# EAGLE design photodiode_board (EAGLE 7.2.0)
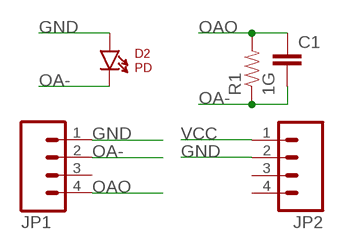
[diagram p0: schematic, sheet 1]

## Parts
C1  CAPPTH  [CAP-PTH-SMALL]
D2  PD  LTE-302  [LTE-302]
JP1  M04PTH  [1X04]
JP2  M04PTH  [1X04]
R1  1G  RESISTORAXIAL-0.3  [AXIAL-0.3]

## Nets
GND: D2.A JP1.1 JP2.2
OA-: C1.2 D2.C JP1.2 R1.P$1
OAO: C1.1 JP1.4 R1.P$2
VCC: JP2.1
Unconnected: JP1.3 JP2.3 JP2.4

## Library data of the parts
C1 = SparkFun-Capacitors:CAP: Capacitor Standard 0603 ceramic capacitor, and 0.1" leaded capacitor.
D2 = SparkFun-LED:LTE-302: Through-hole side-firing 940nm IR LED
JP1 JP2 = SparkFun-Connectors:M04: Header 4 Standard 4-pin 0.1" header. Use with straight break away headers (SKU : PRT-00116), right angle break away headers (PRT-00553), swiss pins (PRT-00743), machine pins (PRT-00117), and female headers (PRT-00115). Molex polarized connector foot print use with SKU : PRT-08231 with associated crimp pins and housings. 1MM SMD Version SKU: PRT-10208
R1 = SparkFun-Resistors:RESISTOR: Resistor Basic schematic elements and footprints for 0603, 1206, and PTH resistors.

## Board
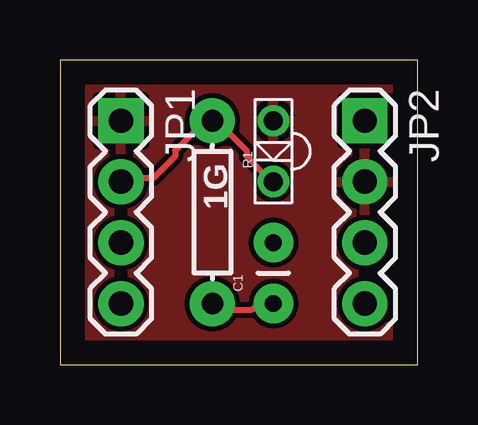
[diagram p1: board, top side]
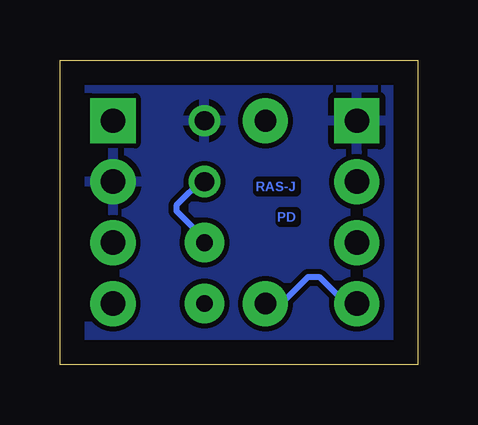
[diagram p2: board, bottom side, seen from below]

Size 14.91 x 12.69 mm. Coordinates in mm from the lower left corner, seen from the top.
Outline: 0,0 14.91,0 14.91,12.69 0,12.69 0,0
Copper layers (1*16): Top 0.035mm / dielectric 1.5mm / Bottom 0.035mm
Design rules "default": minimum track width 10mil, minimum drill 24mil, track to track 8mil, track to pad 8mil, pad to pad 8mil, via to via 8mil, smd to smd 8mil, copper to edge 40mil, drill to drill 8mil, minimum pad ring 10mil, minimum via ring 8mil, stop-mask expansion 4mil, vias tented up to drill 0mil, thermal gap 10mil

### Footprints (pad centres in the part's own frame; a part is rotated, then mirrored left to right if it is on the bottom)
CAP-PTH-SMALL = drill 0.7 pad 1.651: 1 0,0; 2 2.54,0
LTE-302 = drill 0.8: A 1.27,0; C -1.27,0
1X04 = drill 1.016 pad 1.88 square: 1 0,0 | drill 1.016 pad 1.88: 2 2.54,0; 3 5.08,0; 4 7.62,0
AXIAL-0.3 = drill 0.9 pad 1.88: P$1 -3.81,0; P$2 3.81,0

### Placement (x,y rotation side)
C1  8.89,2.54 90 top
D2  8.89,8.89 90 top
JP1  2.54,10.16 270 top
JP2  12.7,10.16 270 top
R1  6.35,6.35 270 top

### Tracks (layer width: path | path; a pad name or v marks a point on that pad's centre or on a via)
GND
  pour Top: 0,12.7 15.24,12.7 15.24,0 0,0
  pour Bottom: 0,12.7 15.24,12.7 15.24,0 0,0
OA-
  Top 0.254: D2.C 8.69,7.77 7.77,8.69 7.77,8.91 6.4,10.29 R1.P$1 6.17,10.29 4.8,8.91 4.8,8.69 3.89,7.77 2.74,7.77 JP1.2
  Bottom 0.254: C1.2 8.91,5.26 10.06,6.4 10.06,6.63 8.91,7.77 D2.C
OAO
  Top 0.254: C1.1 8.69,2.52 8.23,2.52 8,2.29 6.63,2.29 6.4,2.52 R1.P$2
  Bottom 0.254: JP1.4 2.74,2.74 3.2,2.74 4.12,3.66 4.57,3.66 5.49,2.74 6.17,2.74 R1.P$2

### Text on the board
Bottom: RAS-J | PD